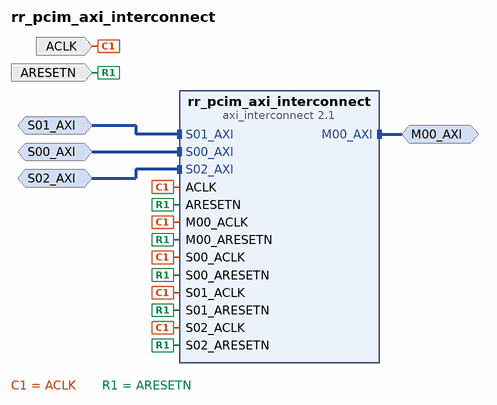
[diagram p0: block diagram of the top level]
# Vivado block design rr_pcim_axi_interconnect, xcvu9p-flgb2104-2-i, Vivado 2020.2
create_bd_design rr_pcim_axi_interconnect

create_bd_intf_port -mode Slave -vlnv xilinx.com:interface:aximm_rtl:1.0 S00_AXI
set_property -dict [list \
  CONFIG.ADDR_WIDTH 64 \
  CONFIG.ARUSER_WIDTH 0 \
  CONFIG.AWUSER_WIDTH 0 \
  CONFIG.BUSER_WIDTH 0 \
  CONFIG.DATA_WIDTH 512 \
  CONFIG.FREQ_HZ 250000000 \
  CONFIG.HAS_BRESP 1 \
  CONFIG.HAS_BURST 1 \
  CONFIG.HAS_CACHE 1 \
  CONFIG.HAS_LOCK 1 \
  CONFIG.HAS_PROT 1 \
  CONFIG.HAS_QOS 1 \
  CONFIG.HAS_REGION 1 \
  CONFIG.HAS_RRESP 1 \
  CONFIG.HAS_WSTRB 1 \
  CONFIG.ID_WIDTH 14 \
  CONFIG.MAX_BURST_LENGTH 256 \
  CONFIG.NUM_READ_OUTSTANDING 32 \
  CONFIG.NUM_READ_THREADS 16 \
  CONFIG.NUM_WRITE_OUTSTANDING 32 \
  CONFIG.NUM_WRITE_THREADS 16 \
  CONFIG.PROTOCOL AXI4 \
  CONFIG.READ_WRITE_MODE READ_WRITE \
  CONFIG.RUSER_BITS_PER_BYTE 0 \
  CONFIG.RUSER_WIDTH 0 \
  CONFIG.SUPPORTS_NARROW_BURST 1 \
  CONFIG.WUSER_BITS_PER_BYTE 0 \
  CONFIG.WUSER_WIDTH 0 \
] [get_bd_intf_ports S00_AXI]
create_bd_intf_port -mode Master -vlnv xilinx.com:interface:aximm_rtl:1.0 M00_AXI
set_property -dict [list \
  CONFIG.ADDR_WIDTH 64 \
  CONFIG.DATA_WIDTH 512 \
  CONFIG.FREQ_HZ 250000000 \
  CONFIG.NUM_READ_OUTSTANDING 32 \
  CONFIG.NUM_WRITE_OUTSTANDING 32 \
  CONFIG.PROTOCOL AXI4 \
] [get_bd_intf_ports M00_AXI]
create_bd_intf_port -mode Slave -vlnv xilinx.com:interface:aximm_rtl:1.0 S01_AXI
set_property -dict [list \
  CONFIG.ADDR_WIDTH 64 \
  CONFIG.ARUSER_WIDTH 0 \
  CONFIG.AWUSER_WIDTH 0 \
  CONFIG.BUSER_WIDTH 0 \
  CONFIG.DATA_WIDTH 512 \
  CONFIG.FREQ_HZ 250000000 \
  CONFIG.HAS_BRESP 1 \
  CONFIG.HAS_BURST 1 \
  CONFIG.HAS_CACHE 1 \
  CONFIG.HAS_LOCK 1 \
  CONFIG.HAS_PROT 1 \
  CONFIG.HAS_QOS 1 \
  CONFIG.HAS_REGION 1 \
  CONFIG.HAS_RRESP 1 \
  CONFIG.HAS_WSTRB 1 \
  CONFIG.ID_WIDTH 14 \
  CONFIG.MAX_BURST_LENGTH 256 \
  CONFIG.NUM_READ_OUTSTANDING 32 \
  CONFIG.NUM_READ_THREADS 16 \
  CONFIG.NUM_WRITE_OUTSTANDING 32 \
  CONFIG.NUM_WRITE_THREADS 16 \
  CONFIG.PROTOCOL AXI4 \
  CONFIG.READ_WRITE_MODE WRITE_ONLY \
  CONFIG.RUSER_BITS_PER_BYTE 0 \
  CONFIG.RUSER_WIDTH 0 \
  CONFIG.SUPPORTS_NARROW_BURST 1 \
  CONFIG.WUSER_BITS_PER_BYTE 0 \
  CONFIG.WUSER_WIDTH 0 \
] [get_bd_intf_ports S01_AXI]
create_bd_intf_port -mode Slave -vlnv xilinx.com:interface:aximm_rtl:1.0 S02_AXI
set_property -dict [list \
  CONFIG.ADDR_WIDTH 64 \
  CONFIG.ARUSER_WIDTH 0 \
  CONFIG.AWUSER_WIDTH 0 \
  CONFIG.BUSER_WIDTH 0 \
  CONFIG.DATA_WIDTH 512 \
  CONFIG.FREQ_HZ 250000000 \
  CONFIG.HAS_BRESP 1 \
  CONFIG.HAS_BURST 1 \
  CONFIG.HAS_CACHE 1 \
  CONFIG.HAS_LOCK 1 \
  CONFIG.HAS_PROT 1 \
  CONFIG.HAS_QOS 1 \
  CONFIG.HAS_REGION 1 \
  CONFIG.HAS_RRESP 1 \
  CONFIG.HAS_WSTRB 1 \
  CONFIG.ID_WIDTH 14 \
  CONFIG.MAX_BURST_LENGTH 256 \
  CONFIG.NUM_READ_OUTSTANDING 32 \
  CONFIG.NUM_READ_THREADS 16 \
  CONFIG.NUM_WRITE_OUTSTANDING 32 \
  CONFIG.NUM_WRITE_THREADS 16 \
  CONFIG.PROTOCOL AXI4 \
  CONFIG.READ_WRITE_MODE READ_WRITE \
  CONFIG.RUSER_BITS_PER_BYTE 0 \
  CONFIG.RUSER_WIDTH 0 \
  CONFIG.SUPPORTS_NARROW_BURST 1 \
  CONFIG.WUSER_BITS_PER_BYTE 0 \
  CONFIG.WUSER_WIDTH 0 \
] [get_bd_intf_ports S02_AXI]
create_bd_port -dir I -type clk ACLK
set_property -dict {CONFIG.ASSOCIATED_BUSIF S00_AXI:M00_AXI:S01_AXI:S02_AXI CONFIG.FREQ_HZ 250000000} [get_bd_ports ACLK]
create_bd_port -dir I -type rst ARESETN

create_bd_cell -type ip -vlnv xilinx.com:ip:axi_interconnect:2.1 rr_pcim_axi_interconnect
set_property -dict [list \
  CONFIG.ENABLE_ADVANCED_OPTIONS 1 \
  CONFIG.ENABLE_PROTOCOL_CHECKERS 0 \
  CONFIG.M00_HAS_REGSLICE 4 \
  CONFIG.M01_HAS_REGSLICE 4 \
  CONFIG.M02_HAS_REGSLICE 4 \
  CONFIG.M03_HAS_REGSLICE 4 \
  CONFIG.NUM_MI 1 \
  CONFIG.NUM_SI 3 \
  CONFIG.PCHK_MAX_RD_BURSTS 32 \
  CONFIG.PCHK_MAX_WR_BURSTS 32 \
  CONFIG.S00_ARB_PRIORITY 1 \
  CONFIG.S00_HAS_REGSLICE 4 \
  CONFIG.S01_ARB_PRIORITY 1 \
  CONFIG.S01_HAS_REGSLICE 4 \
  CONFIG.S02_HAS_REGSLICE 4 \
] [get_bd_cells rr_pcim_axi_interconnect]

# ---- connections ----

connect_bd_intf_net [get_bd_intf_ports S01_AXI] [get_bd_intf_pins rr_pcim_axi_interconnect/S01_AXI]
connect_bd_intf_net [get_bd_intf_ports S00_AXI] [get_bd_intf_pins rr_pcim_axi_interconnect/S00_AXI]
connect_bd_intf_net [get_bd_intf_ports S02_AXI] [get_bd_intf_pins rr_pcim_axi_interconnect/S02_AXI]
connect_bd_intf_net -intf_net axi_interconnect_0_M00_AXI [get_bd_intf_ports M00_AXI] [get_bd_intf_pins rr_pcim_axi_interconnect/M00_AXI]
connect_bd_net [get_bd_ports ACLK] \
  [get_bd_pins rr_pcim_axi_interconnect/ACLK] [get_bd_pins rr_pcim_axi_interconnect/S00_ACLK] \
  [get_bd_pins rr_pcim_axi_interconnect/S01_ACLK] [get_bd_pins rr_pcim_axi_interconnect/M00_ACLK] \
  [get_bd_pins rr_pcim_axi_interconnect/S02_ACLK]
connect_bd_net [get_bd_ports ARESETN] \
  [get_bd_pins rr_pcim_axi_interconnect/ARESETN] [get_bd_pins rr_pcim_axi_interconnect/S00_ARESETN] \
  [get_bd_pins rr_pcim_axi_interconnect/S01_ARESETN] [get_bd_pins rr_pcim_axi_interconnect/M00_ARESETN] \
  [get_bd_pins rr_pcim_axi_interconnect/S02_ARESETN]

# ---- address map ----
assign_bd_address -offset 0x0000000000000000 -range 16E -target_address_space [get_bd_addr_spaces S00_AXI] [get_bd_addr_segs M00_AXI/Reg]
assign_bd_address -offset 0x0000000000000000 -range 16E -target_address_space [get_bd_addr_spaces S01_AXI] [get_bd_addr_segs M00_AXI/Reg]
assign_bd_address -offset 0x0000000000000000 -range 16E -target_address_space [get_bd_addr_spaces S02_AXI] [get_bd_addr_segs M00_AXI/Reg]

validate_bd_design
save_bd_design
